# EAGLE schematic Zentrale (EAGLE 6.4)
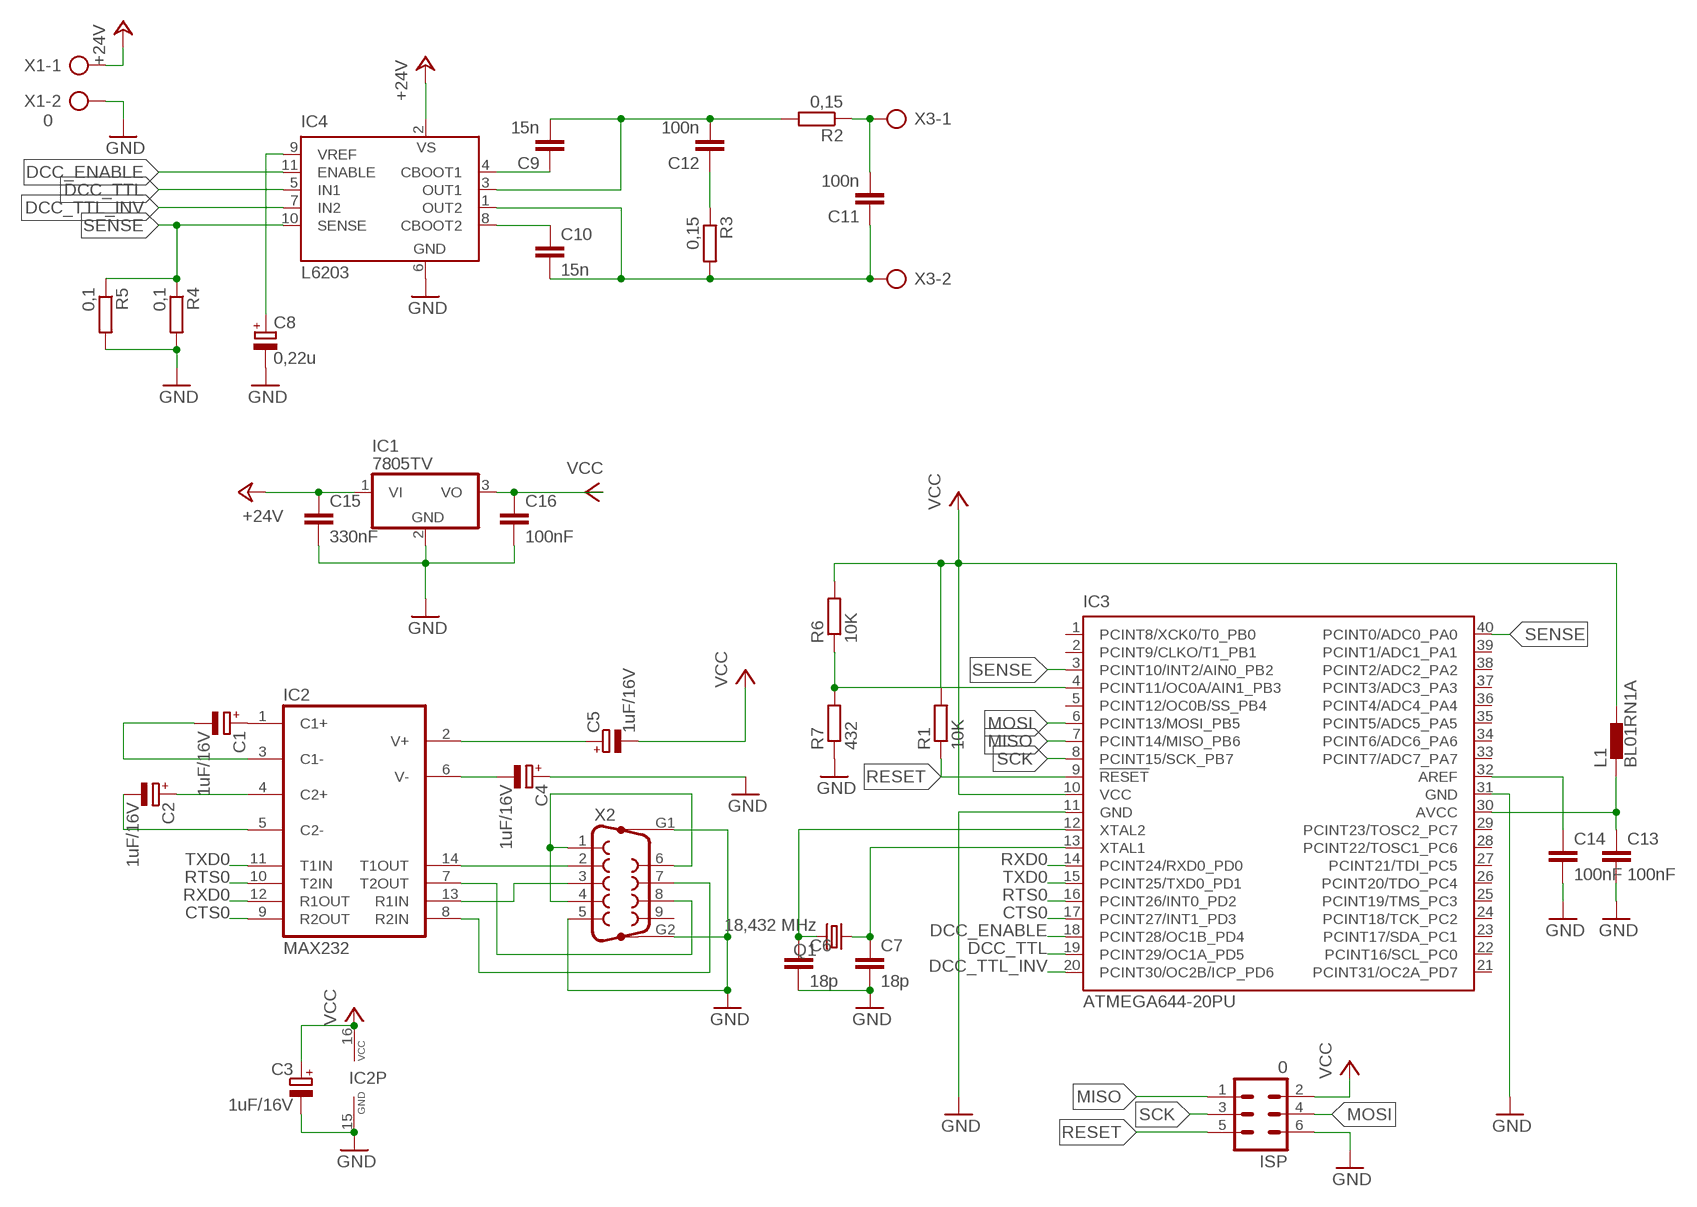
[diagram p0: schematic, sheet 1]

## Parts
C1  1uF/16V  CPOL-EUTT2D5  [TT2D5]
C2  1uF/16V  CPOL-EUTT2D5  [TT2D5]
C3  1uF/16V  CPOL-EUTT2D5  [TT2D5]
C4  1uF/16V  CPOL-EUTT2D5  [TT2D5]
C5  1uF/16V  CPOL-EUTT2D5  [TT2D5]
C6  18p  C-EU025-025X050  [C025-025X050]
C7  18p  C-EU025-025X050  [C025-025X050]
C8  0,22u  CPOL-EUTT2D5  [TT2D5]
C9  15n  C-EU025-025X050  [C025-025X050]
C10  15n  C-EU025-025X050  [C025-025X050]
C11  100n  C-EU025-025X050  [C025-025X050]
C12  100n  C-EU025-025X050  [C025-025X050]
C13  100nF  C-EU025-025X050  [C025-025X050]
C14  100nF  C-EU025-025X050  [C025-025X050]
C15  330nF  C-EU025-025X050  [C025-025X050]
C16  100nF  C-EU025-025X050  [C025-025X050]
IC1  7805TV  [TO220V]
IC2  MAX232  [DIL16]
IC3  ATMEGA644-20PU  [DIL40]
IC4  L6203  [MULTIWATT-11]
ISP  0  ML6  [ML6]
L1  BL01RN1A  [BL01RN1A]
Q1  18,432 MHz  CRYSTALHC18U-V  [HC18U-V]
R1  10K  R-EU_0204/5  [0204/5]
R2  0,15  R-EU_0204/5  [0204/5]
R3  0,15  R-EU_0204/5  [0204/5]
R4  0,1  R-EU_0204/5  [0204/5]
R5  0,1  R-EU_0204/5  [0204/5]
R6  10K  R-EU_0204/5  [0204/5]
R7  432  R-EU_0204/5  [0204/5]
X1  0  AK500/2  [AK500/2]
X2  F09HP  [F09HP]
X3  AK500/2  [AK500/2]

## Nets
+24V: C15.1 IC1.1(VI) IC4.2(VS) X1.1
CTS0: IC2.9(R2OUT) IC3.17(PCINT27/INT1_PD3)
DCC_ENABLE: IC3.18(PCINT28/OC1B_PD4) IC4.11(ENABLE)
DCC_TTL: IC3.19(PCINT29/OC1A_PD5) IC4.5(IN1)
DCC_TTL_INV: IC3.20(PCINT30/OC2B/ICP_PD6) IC4.7(IN2)
GND: C3.- C4.+ C6.2 C7.2 C8.- C13.2 C14.2 C15.2 C16.2 IC1.2(GND) IC2.15(GND) IC3.11(GND) IC3.31(GND) IC4.6(GND) ISP.6 R4.2 R5.2 R7.1 X1.2 X2.5 X2.G1 X2.G2
MISO: IC3.7(PCINT14/MISO_PB6) ISP.1
MOSI: IC3.6(PCINT13/MOSI_PB5) ISP.4
N$1: IC2.7(T2OUT) X2.8
N$2: IC2.8(R2IN) X2.7
N$3: C8.+ IC4.9(VREF)
N$4: C11.2 R2.1 X3.1
N$5: C12.1 R3.1
N$6: IC2.14(T1OUT) X2.2
N$7: IC2.13(R1IN) X2.3
N$8: C1.+ IC2.1(C1+)
N$9: C1.- IC2.3(C1-)
N$10: C2.+ IC2.4(C2+)
N$11: C2.- IC2.5(C2-)
N$12: C4.- IC2.6(V-)
N$13: C5.+ IC2.2(V+)
N$14: C14.1 IC3.32(AREF)
N$15: C6.1 IC3.12(XTAL2) Q1.2
N$16: C7.1 IC3.13(XTAL1) Q1.1
N$17: C9.2 C12.2 IC4.3(OUT1) R2.2
N$18: C10.2 C11.1 IC4.1(OUT2) R3.2 X3.2
N$19: C10.1 IC4.8(CBOOT2)
N$20: C13.1 IC3.30(AVCC) L1.1
N$21: C9.1 IC4.4(CBOOT1)
N$22: X2.1 X2.4 X2.6
N$23: IC3.4(PCINT11/OC0A/AIN1_PB3) R6.1 R7.2
RESET: IC3.9(!RESET) ISP.5 R1.1
RTS0: IC2.10(T2IN) IC3.16(PCINT26/INT0_PD2)
RXD0: IC2.12(R1OUT) IC3.14(PCINT24/RXD0_PD0)
SCK: IC3.8(PCINT15/SCK_PB7) ISP.3
SENSE: IC3.3(PCINT10/INT2/AIN0_PB2) IC3.40(PCINT0/ADC0_PA0) IC4.10(SENSE) R4.1 R5.1
TXD0: IC2.11(T1IN) IC3.15(PCINT25/TXD0_PD1)
VCC: C3.+ C5.- C16.1 IC1.3(VO) IC2.16(VCC) IC3.10(VCC) ISP.2 L1.2 R1.2 R6.2
Unconnected: IC3.1(PCINT8/XCK0/T0_PB0) IC3.2(PCINT9/CLKO/T1_PB1) IC3.5(PCINT12/OC0B/SS_PB4) IC3.21(PCINT31/OC2A_PD7) IC3.22(PCINT16/SCL_PC0) IC3.23(PCINT17/SDA_PC1) IC3.24(PCINT18/TCK_PC2) IC3.25(PCINT19/TMS_PC3) IC3.26(PCINT20/TDO_PC4) IC3.27(PCINT21/TDI_PC5) IC3.28(PCINT22/TOSC1_PC6) IC3.29(PCINT23/TOSC2_PC7) IC3.33(PCINT7/ADC7_PA7) IC3.34(PCINT6/ADC6_PA6) IC3.35(PCINT5/ADC5_PA5) IC3.36(PCINT4/ADC4_PA4) IC3.37(PCINT3/ADC3_PA3) IC3.38(PCINT2/ADC2_PA2) IC3.39(PCINT1/ADC1_PA1) X2.9

## Library data of the parts
C1-C5 C8 = resistor:CPOL-EU: POLARIZED CAPACITOR, European symbol
C6 C7 C9-C16 = resistor:C-EU: CAPACITOR, European symbol
IC1 = linear:78*: Positive VOLTAGE REGULATOR Source: http://cache.national.com/ds/LM/LM78L05.pdf http://www.fairchildsemi.com/ds/LM/LM7805.pdf
IC2 = maxim:MAX232: RS232 TRANSEIVER; MF: MAXIM; MPN: MAX232ACPE+; OC_FARNELL: 9723773; OC_NEWARK: 68K4544
IC3 = atmel:ATMEGA644-*PU: 8-bit Microcontroller with 64K Bytes In-System Programmable Flash Auto generated by make-symbol-device-package-bsdl.ulp Rev. 34 Source: http://www.atmel.com/dyn/resources/prod_documents/doc2593.pdf; MPN: ATMEGA644-20PU; OC_FARNELL: 1288340; OC_NEWARK: 23M5060
IC4 = st-microelectronics:L6203: DMOS FULL BRIDGE DRIVER; MPN: L6203; OC_FARNELL: 1467715; OC_NEWARK: 56P8434
ISP = con-harting-ml:ML6: HARTING; OC_FARNELL: unknown; OC_NEWARK: unknown
L1 = inductors:BL0: Noise Suppression Products/EMI Suppression Filters, Lead EMIFIL(R) Inductor Type Source: http://www.murata.com .. BL01RN1_DS.pdf
Q1 = crystal:CRYSTAL: CRYSTAL; OC_FARNELL: unknown; OC_NEWARK: unknown
R1-R7 = resistor:R-EU_: RESISTOR, European symbol
X1 X3 = con-ptr500:AK500/2: CONNECTOR; OC_FARNELL: unknown; OC_NEWARK: unknown
X2 = con-subd:F09HP: SUB-D; OC_FARNELL: unknown; OC_NEWARK: unknown